# EAGLE design room_ind (EAGLE 6.3)
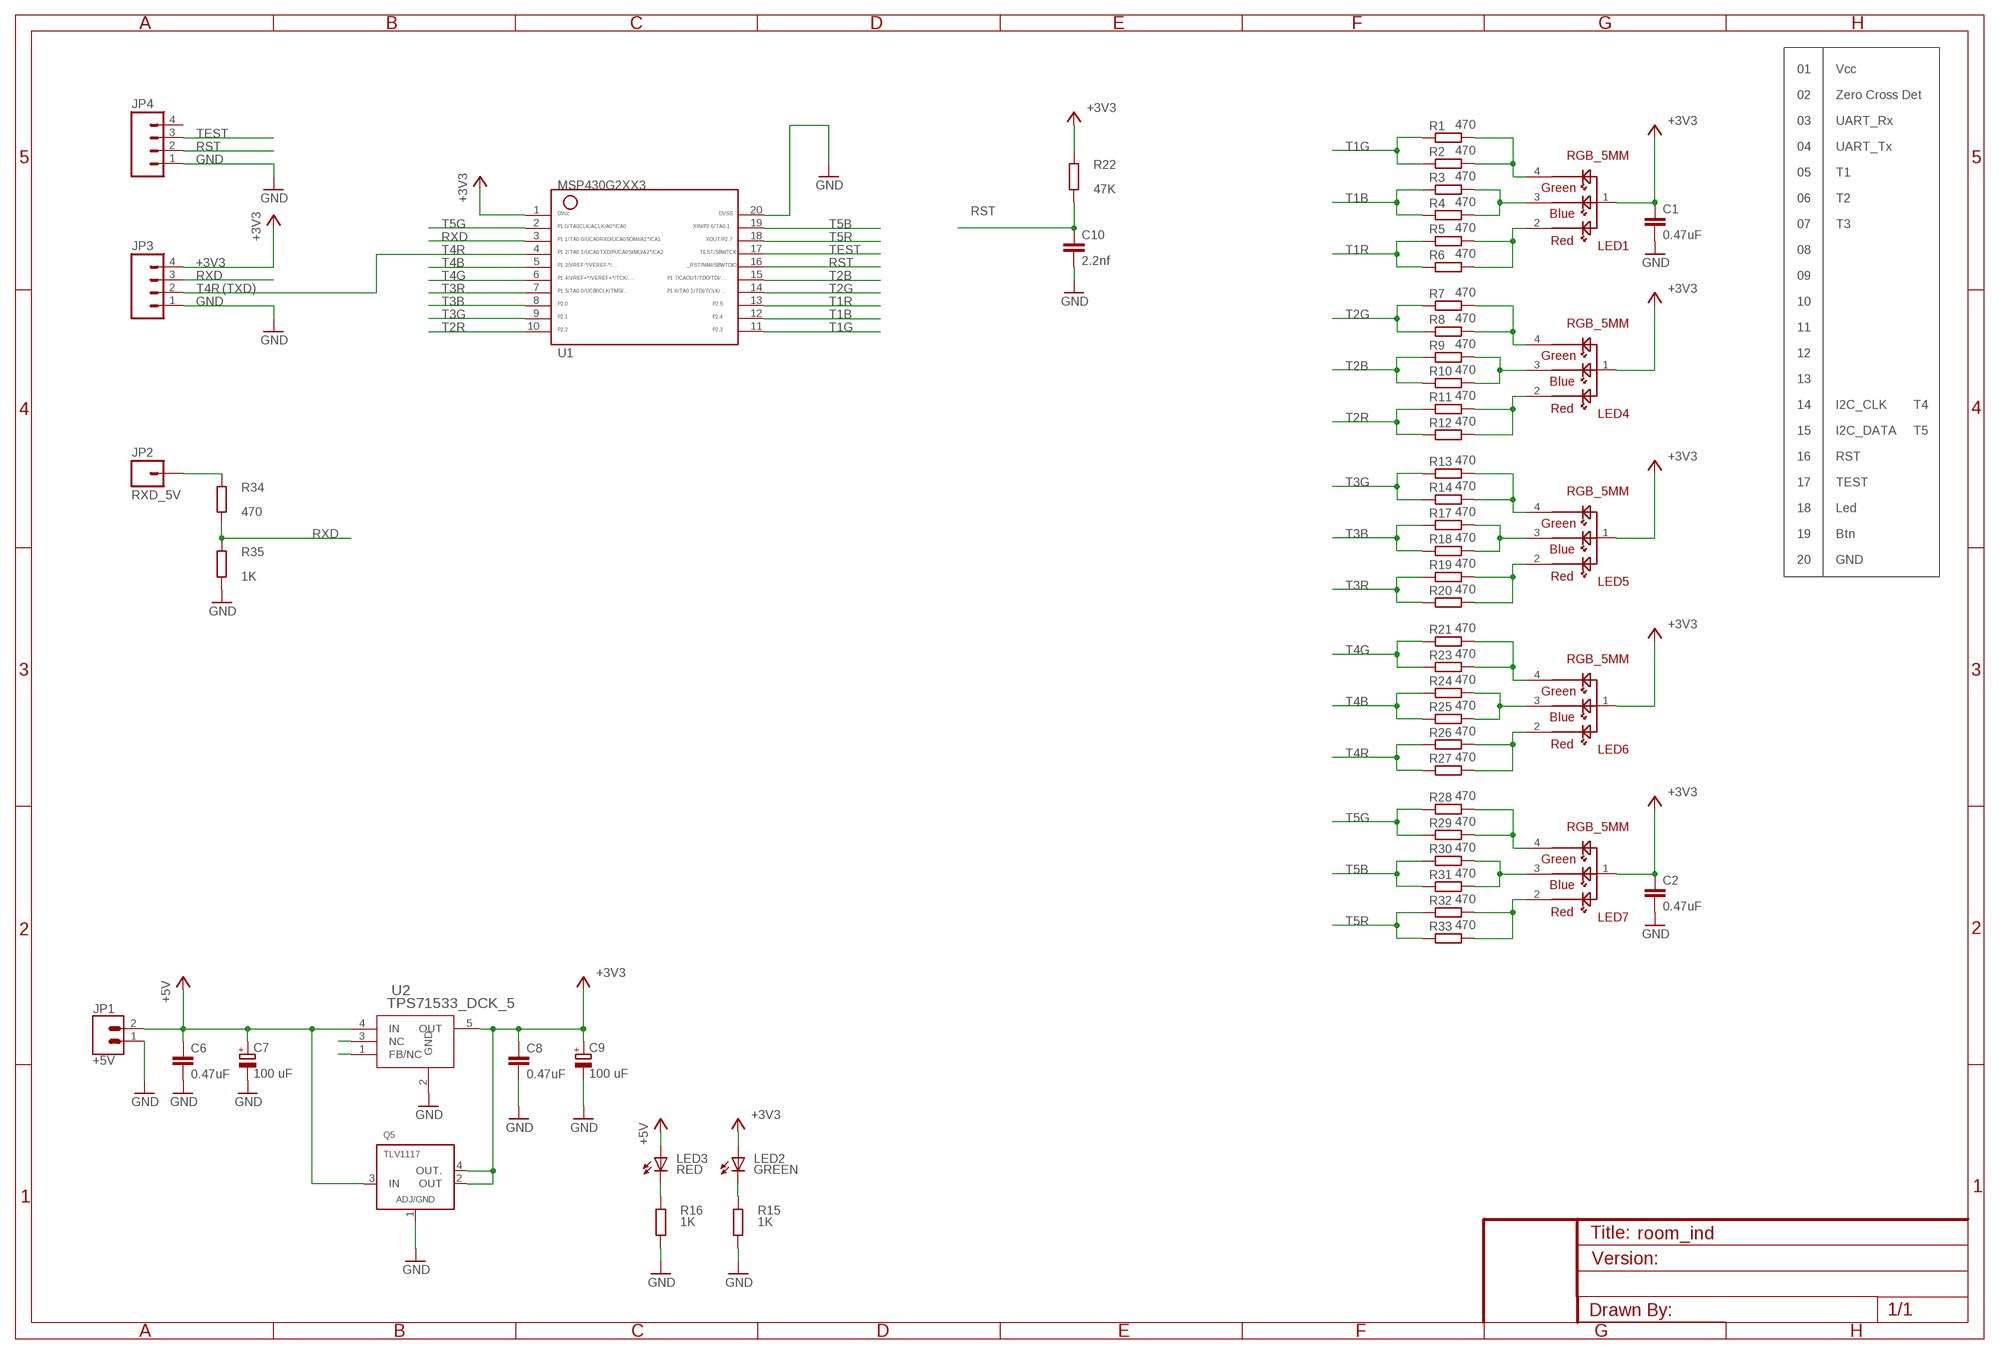
[diagram p0: schematic, sheet 1]

## Parts
C1  0.47uF  C-EUC0805  [C0805]
C2  0.47uF  C-EUC0805  [C0805]
C6  0.47uF  C-EUC0805  [C0805]
C7  100 uF  CPOL-EUE2.5-7  [E2,5-7]
C8  0.47uF  C-EUC0805  [C0805]
C9  100 uF  CPOL-EUE2.5-7  [E2,5-7]
C10  2.2nf  C-EUC0805  [C0805]
JP1  +5V  BLUE_TERM  [BLUE_TERM]
JP2  RXD_5V  M01PTH  [1X01]
JP3  M04PTH  [1X04]
JP4  M04PTH  [1X04]
LED1  RGB_5MM  [RGB_5MM]
LED2  GREEN  LEDCHIP-LED0805  [CHIP-LED0805]
LED3  RED  LEDCHIP-LED0805  [CHIP-LED0805]
LED4  RGB_5MM  [RGB_5MM]
LED5  RGB_5MM  [RGB_5MM]
LED6  RGB_5MM  [RGB_5MM]
LED7  RGB_5MM  [RGB_5MM]
Q5  TLV1117  [SOT223-4]
R1  470  R-EU_R0805  [R0805]
R2  470  R-EU_0207/7  [0207/7]
R3  470  R-EU_R0805  [R0805]
R4  470  R-EU_0207/7  [0207/7]
R5  470  R-EU_R0805  [R0805]
R6  470  R-EU_0207/7  [0207/7]
R7  470  R-EU_R0805  [R0805]
R8  470  R-EU_0207/7  [0207/7]
R9  470  R-EU_R0805  [R0805]
R10  470  R-EU_0207/7  [0207/7]
R11  470  R-EU_R0805  [R0805]
R12  470  R-EU_0207/7  [0207/7]
R13  470  R-EU_R0805  [R0805]
R14  470  R-EU_0207/7  [0207/7]
R15  1K  R-EU_R0805  [R0805]
R16  1K  R-EU_R0805  [R0805]
R17  470  R-EU_R0805  [R0805]
R18  470  R-EU_0207/7  [0207/7]
R19  470  R-EU_R0805  [R0805]
R20  470  R-EU_0207/7  [0207/7]
R21  470  R-EU_R0805  [R0805]
R22  47K  R-EU_R0805  [R0805]
R23  470  R-EU_0207/7  [0207/7]
R24  470  R-EU_R0805  [R0805]
R25  470  R-EU_0207/7  [0207/7]
R26  470  R-EU_R0805  [R0805]
R27  470  R-EU_0207/7  [0207/7]
R28  470  R-EU_R0805  [R0805]
R29  470  R-EU_0207/7  [0207/7]
R30  470  R-EU_R0805  [R0805]
R31  470  R-EU_0207/7  [0207/7]
R32  470  R-EU_R0805  [R0805]
R33  470  R-EU_0207/7  [0207/7]
R34  470  R-EU_R0805  [R0805]
R35  1K  R-EU_R0805  [R0805]
U1  G2XX3---PW20  [PW20]
U2  TPS71533_DCK_5  [DCK5]

## Nets
+3V3 [3V]: C1.1 C2.1 C8.1 C9.+ JP3.4 LED1.1 LED2.A LED4.1 LED5.1 LED6.1 LED7.1 Q5.2(OUT) Q5.4(OUT.) R22.2 U1.1 U2.5(OUT)
+5V [5V]: C6.1 C7.+ JP1.2 LED3.A Q5.3(IN) U2.4(IN)
GND [GND]: C1.2 C2.2 C6.2 C7.- C8.2 C9.- C10.2 JP1.1 JP3.1 JP4.1 Q5.1(ADJ/GND) R15.1 R16.1 R35.1 U1.20 U2.2(GND)
N$1: LED1.3 R3.2 R4.2
N$2: LED1.4 R1.2 R2.2
N$3: LED1.2 R5.2 R6.2
N$4: JP2.1 R34.2
N$7: LED2.C R15.2
N$8: LED3.C R16.2
N$10: LED4.3 R9.2 R10.2
N$11: LED4.4 R7.2 R8.2
N$12: LED4.2 R11.2 R12.2
N$16: LED5.3 R17.2 R18.2
N$17: LED5.4 R13.2 R14.2
N$18: LED5.2 R19.2 R20.2
N$22: LED6.3 R24.2 R25.2
N$23: LED6.4 R21.2 R23.2
N$24: LED6.2 R26.2 R27.2
N$28: LED7.3 R30.2 R31.2
N$29: LED7.4 R28.2 R29.2
N$30: LED7.2 R32.2 R33.2
N$32: U2.3(NC)
N$33: U2.1(FB/NC)
RST: C10.1 JP4.2 R22.1 U1.16
RXD: JP3.3 R34.1 R35.2 U1.3
T1B: R3.1 R4.1 U1.12
T1G: R1.1 R2.1 U1.11
T1R: R5.1 R6.1 U1.13
T2B: R9.1 R10.1 U1.15
T2G: R7.1 R8.1 U1.14
T2R: R11.1 R12.1 U1.10
T3B: R17.1 R18.1 U1.8
T3G: R13.1 R14.1 U1.9
T3R: R19.1 R20.1 U1.7
T4B: R24.1 R25.1 U1.5
T4G: R21.1 R23.1 U1.6
T4R: JP3.2 R26.1 R27.1 U1.4
T5B: R30.1 R31.1 U1.19
T5G: R28.1 R29.1 U1.2
T5R: R32.1 R33.1 U1.18
TEST: JP4.3 U1.17
Unconnected: JP4.4

## Notes on the sheet
- 01 | Vcc
- 02 | Zero Cross Det
- 03 | UART_Rx
- 04 | UART_Tx
- 05 | T1
- 06 | T2
- 07 | T3
- 08
- 09
- (TXD)
- 10
- 11
- 12
- 13
- 14 | I2C_CLK | T4
- 15 | I2C_DATA | T5
- 16 | RST
- 17 | TEST
- 18 | Led
- 19 | Btn
- 20 | GND

## Library data of the parts
C1 C2 C6 C8 C10 = rcl:C-EU: CAPACITOR, European symbol
C7 C9 = rcl:CPOL-EU: POLARIZED CAPACITOR, European symbol
JP1 = jlab:BLUE_TERM
JP2 = SparkFun-Connectors:M01: Header 1 Standard 1-pin 0.1" header. Use with straight break away headers (SKU : PRT-00116), right angle break away headers (PRT-00553), swiss pins (PRT-00743), machine pins (PRT-00117), and female headers (PRT-00115).
JP3 JP4 = SparkFun:M04: Header 4 Standard 4-pin 0.1" header. Use with straight break away headers (SKU : PRT-00116), right angle break away headers (PRT-00553), swiss pins (PRT-00743), machine pins (PRT-00117), and female headers (PRT-00115). Molex polarized connector foot print use with SKU : PRT-08231 with associated crimp pins and housings. 1MM SMD Version SKU: PRT-10208
LED1 LED4-LED7 = jlab:RGB_5MM
LED2 LED3 = jlab:LED: LED OSRAM: - CHIPLED LG R971, LG N971, LY N971, LG Q971, LY Q971, LO R971, LY R971 LH N974, LH R974 LS Q976, LO Q976, LY Q976 LO Q996 - Hyper CHIPLED LW Q18S LB Q993, LB Q99A, LB R99A - SideLED LS A670, LO A670, LY A670, LG A670, LP A670 LB A673, LV A673, LT A673, LW A673 LH A674 LY A675 LS A676, LA A676, LO A676, LY A676, LW A676 LS A679, LY A679, LG A679 - Hyper Micro SIDELED® LS Y876, LA Y876, LO Y876, LY Y876 LT Y87S - SmartLED LW L88C, LW L88S LB L89C, LB L89S, LG L890 LS L89K, LO L89K, LY L89K LS L896, LA L896, LO L896, LY L896 - TOPLED LS T670, LO T670, LY T670, LG T670, LP T670 LSG T670, LSP T670, LSY T670, LOP T670, LYG T670 LG T671, LOG T671, LSG T671 LB T673, LV T673, LT T673, LW T673 LH T674 LS T676, LA T676, LO T676, LY T676, LB T676, LH T676, LSB T676, LW T676 LB T67C, LV T67C, LT T67C, LS T67K, LO T67K, LY T67K, LW E67C LS E67B, LA E67B, LO E67B, LY E67B, LB E67C, LV E67C, LT E67C LW T67C LS T679, LY T679, LG T679 LS T770, LO T770, LY T770, LG T770, LP T770 LB T773, LV T773, LT T773, LW T773 LH T774 LS E675, LA E675, LY E675, LS T675 LS T776, LA T776, LO T776, LY T776, LB T776 LHGB T686 LT T68C, LB T68C - Hyper Mini TOPLED® LB M676 - Mini TOPLED Santana® LG M470 LS M47K, LO M47K, LY M47K Source: http://www.osram.convergy.de LUXEON: - LUMILED® LXK2-PW12-R00, LXK2-PW12-S00, LXK2-PW14-U00, LXK2-PW14-V00 LXK2-PM12-R00, LXK2-PM12-S00, LXK2-PM14-U00 LXK2-PE12-Q00, LXK2-PE12-R00, LXK2-PE12-S00, LXK2-PE14-T00, LXK2-PE14-U00 LXK2-PB12-K00, LXK2-PB12-L00, LXK2-PB12-M00, LXK2-PB14-N00, LXK2-PB14-P00, LXK2-PB14-Q00 LXK2-PR12-L00, LXK2-PR12-M00, LXK2-PR14-Q00, LXK2-PR14-R00 LXK2-PD12-Q00, LXK2-PD12-R00, LXK2-PD12-S00 LXK2-PH12-R00, LXK2-PH12-S00 LXK2-PL12-P00, LXK2-PL12-Q00, LXK2-PL12-R00 Source: www.luxeon.com KINGBRIGHT: KA-3528ASYC Source: www.kingbright.com
Q5 = ti-parts:TLV1117: LDO VOLTAGE REGULATOR
R1-R35 = rcl:R-EU_: RESISTOR, European symbol
U1 = TI_MSP430_v16:G2XX3---PW20: MSP430G2XX1 TSSOP (PW) 20 Pin Package
U2 = ti_exports:TPS71533_DCK_5; DATASHEETURL: http://www.ti.com/lit/gpn/TPS71533; DESCRIPTION: Single Output LDO, 50mA, Fixed(3.3V), High Input Voltage, Low Quiescent Current; FAMILY_NAME: SINGLE CHANNEL LDO; GENERIC_PART_NUMBER: TPS71533; INDUSTRY_STD_PKG_TYPE: SC70; MANUFACTURER: Texas Instruments; MANUFACTURER_PART_NUMBER: tps71533_dck_5; PACKAGE_DESIGNATOR: DCK; PIN_COUNT: 5; VENDOR: Texas Instruments

## Net classes
1 5V: width 0.305 mm, drill 0.305 mm, clearance 0.305 mm
2 3V: width 0.305 mm, drill 0.305 mm, clearance 0.305 mm
3 GND: width 0.305 mm, clearance 0.305 mm

## Board
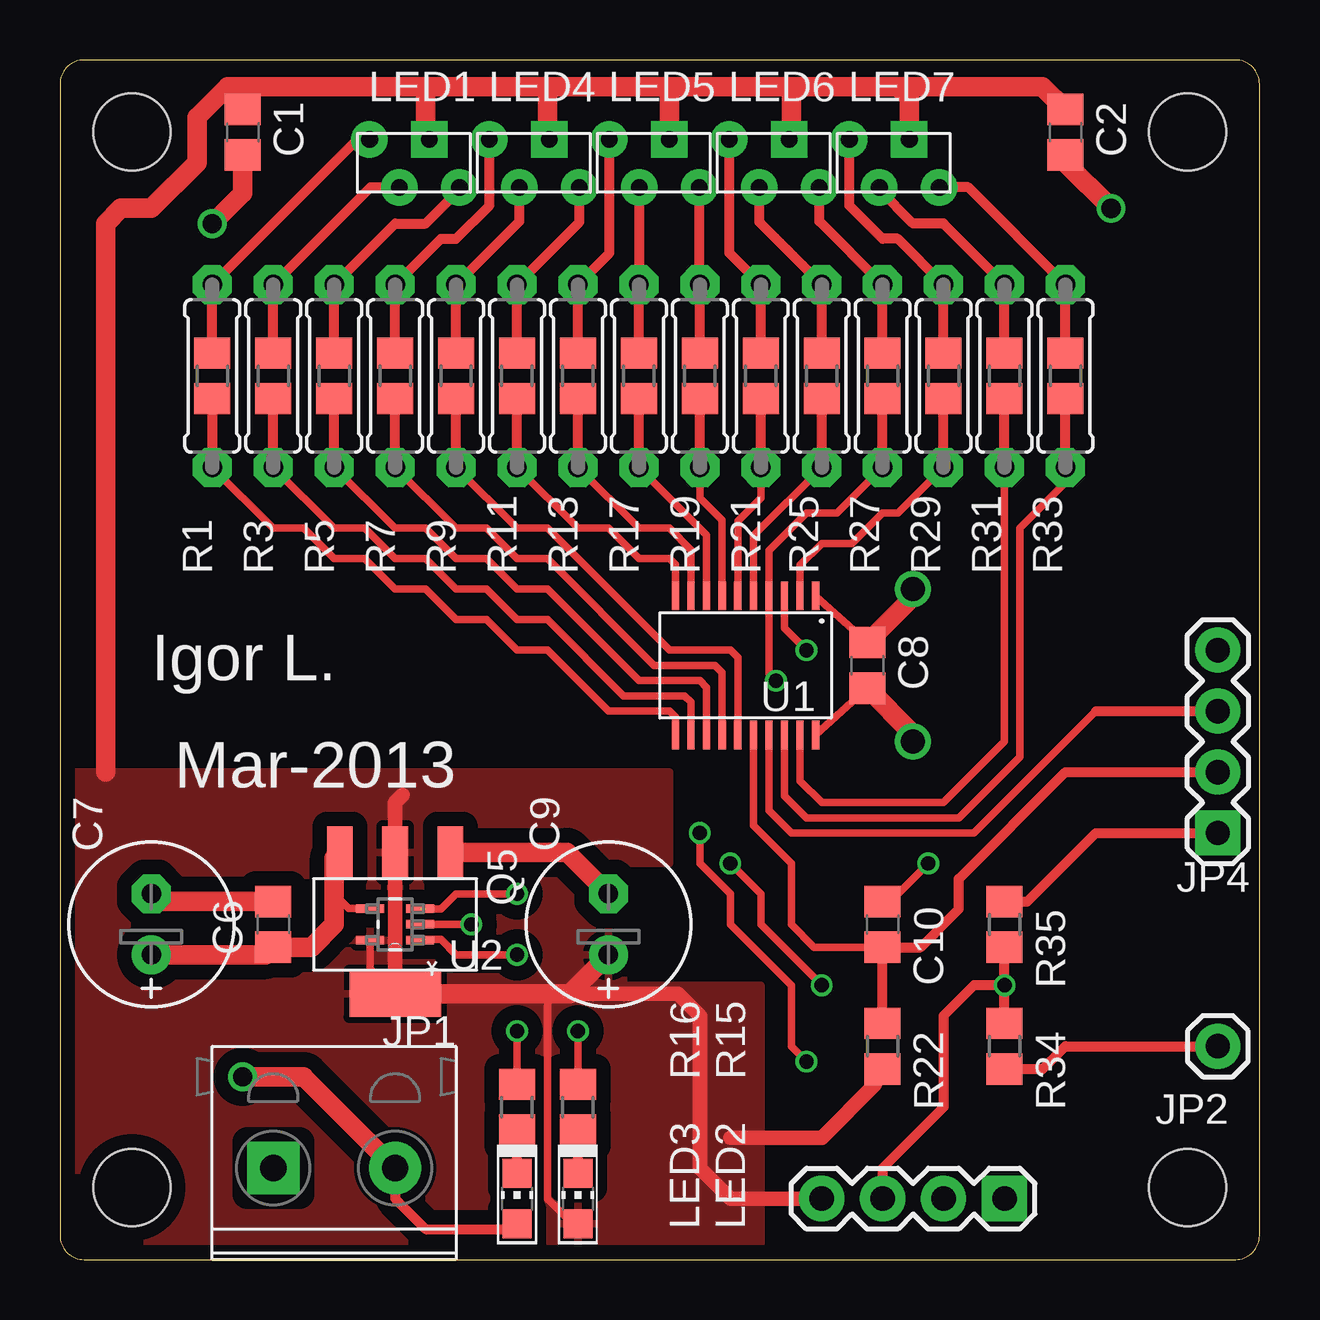
[diagram p1: board, top side]
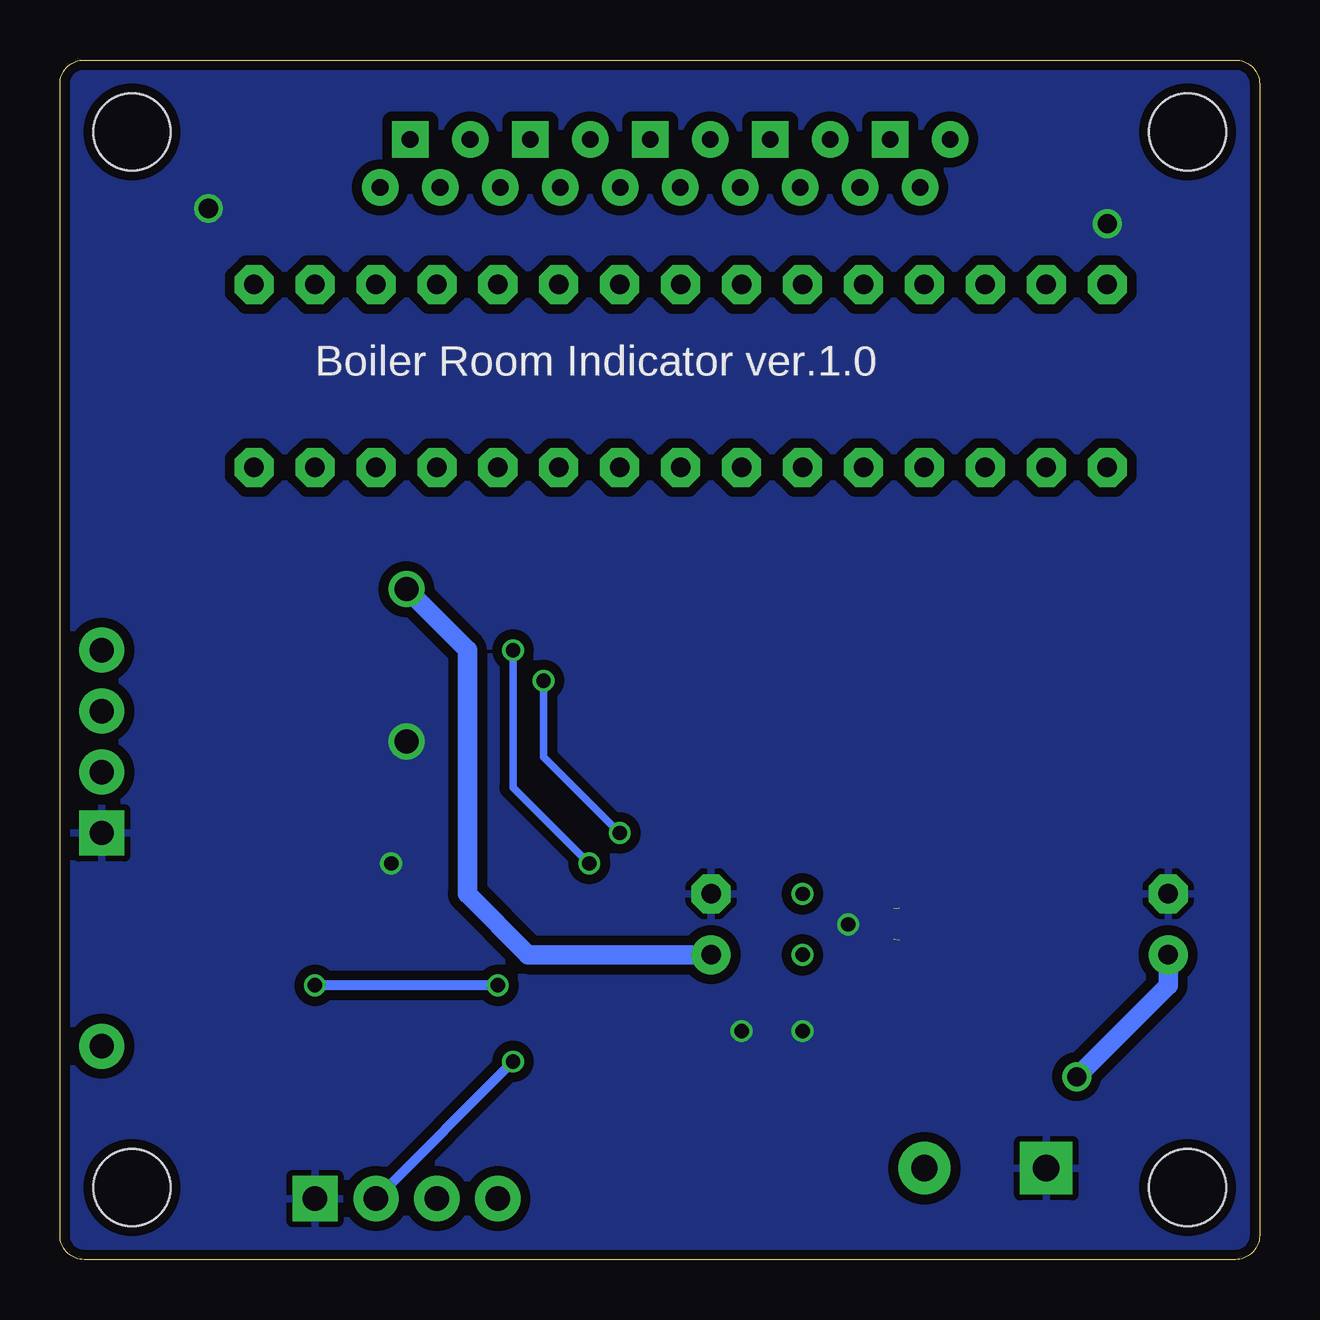
[diagram p2: board, bottom side, seen from below]

Size 50 x 50 mm. Coordinates in mm from the lower left corner, seen from the top.
Outline: 0,1 arc90 1,0 49,0 arc90 50,1 50,49 arc90 49,50 1,50 arc90 0,49 0,1
Copper layers (1*16): Top 0.035mm / dielectric 1.5mm / Bottom 0.035mm
Design rules "msp430 *": minimum track width 11mil, minimum drill 0.6mm, track to track 6mil, track to pad 6mil, pad to pad 6mil, via to via 6mil, smd to smd 0mil, copper to edge 10mil, drill to drill 10mil, minimum pad ring 16mil, minimum via ring 6mil, stop-mask expansion 2mil, vias tented up to drill 40mil, thermal gap 10mil
Holes 3.2 mm at 3,3 47,3 47,47 3,47

### Footprints (pad centres in the part's own frame; a part is rotated, then mirrored left to right if it is on the bottom)
C0805 = smd 1.3 x 1.5: 1 -0.95,0; 2 0.95,0
E2,5-7 = drill 0.813 pad 1.6: + -1.27,0 | drill 0.813 pad 1.6 octagon: - 1.27,0
BLUE_TERM = drill 1.1 pad 2.184 square: 1 0,2.54 | drill 1.1 pad 2.184: 2 0,-2.54
1X01 = drill 1.016 pad 1.88: 1 0,0
1X04 = drill 1.016 pad 1.88 square: 1 0,0 | drill 1.016 pad 1.88: 2 2.54,0; 3 5.08,0; 4 7.62,0
RGB_5MM = drill 0.7 square: 1 -0.969,1.27 | drill 0.7: 2 1.031,2.52; 3 1.031,0.02; 4 -0.969,-1.23
CHIP-LED0805 = smd 1.2 x 1.2: A 0,-1.05; C 0,1.05
SOT223-4 = smd 1.067 x 2.184: 1 -2.3,-3; 2 0,-3; 3 2.3,-3 | smd 3.81 x 1.93: 4 0,2.9
R0805 = smd 1.3 x 1.5: 1 -0.95,0; 2 0.95,0
0207/7 = drill 0.813 octagon: 1 -3.81,0; 2 3.81,0
PW20 = smd 0.3 x 1.2: 1 -2.925,-2.9; 2 -2.275,-2.9; 3 -1.625,-2.9; 4 -0.975,-2.9; 5 -0.325,-2.9; 6 0.325,-2.9; 7 0.975,-2.9; 8 1.625,-2.9; 9 2.275,-2.9; 10 2.925,-2.9; 11 2.925,2.9; 12 2.275,2.9; 13 1.625,2.9; 14 0.975,2.9; 15 0.325,2.9; 16 -0.325,2.9; 17 -0.975,2.9; 18 -1.625,2.9; 19 -2.275,2.9; 20 -2.925,2.9
DCK5 = smd 1.168 x 0.356: 1 -1.041,0.66; 2 -1.041,0; 3 -1.041,-0.66; 4 1.041,-0.66; 5 1.041,0.66

### Placement (x,y rotation side)
C1  7.62,46.99 270 top
C2  41.91,46.99 270 top
C6  8.89,13.97 90 top
C7  3.81,13.97 90 top
C8  33.66,24.77 270 top
C9  22.86,13.97 90 top
C10  34.29,13.97 90 top
JP1  11.43,3.81 90 top
JP2  48.26,8.89 0 top
JP3  39.37,2.54 180 top
JP4  48.26,17.78 90 top
LED1  14.13,45.72 270 top
LED2  21.59,2.54 0 top
LED3  19.05,2.54 0 top
LED4  19.13,45.72 270 top
LED5  24.13,45.72 270 top
LED6  29.13,45.72 270 top
LED7  34.13,45.72 270 top
Q5  13.97,13.97 180 top
R1  6.35,36.83 90 top
R2  6.35,36.83 90 top
R3  8.89,36.83 90 top
R4  8.89,36.83 90 top
R5  11.43,36.83 90 top
R6  11.43,36.83 90 top
R7  13.97,36.83 90 top
R8  13.97,36.83 90 top
R9  16.51,36.83 90 top
R10  16.51,36.83 90 top
R11  19.05,36.83 90 top
R12  19.05,36.83 90 top
R13  21.59,36.83 90 top
R14  21.59,36.83 90 top
R15  21.59,6.35 270 top
R16  19.05,6.35 270 top
R17  24.13,36.83 90 top
R18  24.13,36.83 90 top
R19  26.67,36.83 90 top
R20  26.67,36.83 90 top
R21  29.21,36.83 90 top
R22  34.29,8.89 270 top
R23  29.21,36.83 90 top
R24  31.75,36.83 90 top
R25  31.75,36.83 90 top
R26  34.29,36.83 90 top
R27  34.29,36.83 90 top
R28  36.83,36.83 90 top
R29  36.83,36.83 90 top
R30  39.37,36.83 90 top
R31  39.37,36.83 90 top
R32  41.91,36.83 90 top
R33  41.91,36.83 90 top
R34  39.37,8.89 270 top
R35  39.37,13.97 270 top
U1  28.57,24.77 180 top
U2  13.97,13.97 180 top

### Tracks (layer width: path | path; a pad name or v marks a point on that pad's centre or on a via)
+3V3  (via drill 1)
  Top 0.305: U2.5 12.93,12.11 Q5.4 | LED2.A 21.37,1.49 20.32,2.54 20.32,11.07 | R22.2 33.97,7.62 | U1.1 C8.1
  Top 0.61: Q5.4 Q5.2 13.97,19.05 14.29,19.37 | JP3.4 27.94,2.54 26.67,3.81 26.67,10.16 25.76,11.07 20.32,11.07 | 33.97,7.62 33.97,7.3 31.75,5.08 27.94,5.08
  Top 0.813: Q5.4 20.32,11.07 21.23,11.07 C9.+ | C8.1 35.56,27.62 v35.56,27.94 | LED7.1 35.4,48.42 34.92,48.9 | 34.92,48.9 30.48,48.9 | 30.48,48.9 25.4,48.9 | 25.4,48.9 20.32,48.9 | 20.32,48.9 15.24,48.9 | 15.24,48.9 7.62,48.9 | 7.62,48.9 6.99,48.9 5.71,47.62 5.71,45.72 3.81,43.81 2.54,43.81 1.91,43.18 1.91,20.32 | LED1.1 15.24,46.85 15.24,48.9 | LED4.1 20.32,46.77 20.32,48.9 | LED5.1 25.4,48.9 | LED6.1 30.48,46.77 30.48,48.9 | 34.92,48.9 40.95,48.9 C2.1 | C1.1 7.62,48.9
  Bottom 0.813: v35.56,27.94 33.02,25.4 33.02,15.24 30.48,12.7 C9.+
  pour Top (isolate 0.61): 0,20.32 25.4,20.32 25.4,16.51 23.5,16.51 23.5,11.43 29.21,11.43 29.21,0 1,0 arc-90 0,1
+5V  (via drill 0.8)
  Top 0.305: U2.4 12.04,14.63 11.43,15.24
  Top 0.406: JP1.2 13.97,2.54 15.24,1.27 18.83,1.27 LED3.A
  Top 0.813: C7.+ 8.57,12.7 C6.1 10.48,13.02 11.43,13.97 11.43,15.24 11.43,16.73 Q5.3 | JP1.2 10.16,7.62 v7.62,7.62
  Bottom 0.813: v7.62,7.62 3.81,11.43 C7.+
GND  (via drill 0.6, 0.8, 1)
  Top 0.305: U2.2 v17.14,13.97 | R16.1 v19.05,9.53 | R15.1 v21.59,9.53 | C10.2 34.6,14.92 v36.2,16.51 | U1.20 C8.2
  Top 0.406: R35.1 40.32,14.92 43.18,17.78 JP4.1
  Top 0.813: C6.2 4.13,14.92 C7.- | Q5.1 21.13,16.97 C9.- | C8.2 35.56,21.91 v35.56,21.59 | C1.2 7.62,44.45 v6.35,43.18 | C2.2 41.91,45.72 v43.81,43.81
  pour Bottom (isolate 0.406, rank 6): 0,49 0,1 arc90 1,0 49,0 arc90 50,1 50,49 arc90 49,50 1,50 arc90
N$1
  Top 0.406: LED1.3 12.94,44.69 R4.2 R3.2
N$2
  Top 0.406: R1.2 R2.2 12.4,46.69 LED1.4
N$3
  Top 0.406: LED1.2 16.65,44.59 15.24,43.18 13.97,43.18 R6.2 R5.2
N$4
  Top 0.406: R34.2 40.96,7.94 41.91,8.89 JP2.1
N$7
  Top 0.406: LED2.C R15.2
N$8
  Top 0.406: LED3.C R16.2
N$10
  Top 0.406: LED4.3 19.15,43.28 R10.2 R9.2
N$11
  Top 0.406: LED4.4 17.9,43.94 16.51,42.55 15.88,42.55 R8.2 R7.2
N$12
  Top 0.406: LED4.2 21.65,43.24 R12.2 R11.2
N$16
  Top 0.406: LED5.3 24.15,40.64 R18.2 R17.2
N$17
  Top 0.406: LED5.4 22.9,41.95 R14.2 R13.2
N$18
  Top 0.406: LED5.2 26.65,40.66 R20.2 R19.2
N$22
  Top 0.406: LED6.3 29.15,43.24 R25.2 R24.2
N$23
  Top 0.406: LED6.4 27.9,41.95 R23.2 R21.2
N$24
  Top 0.406: LED6.2 31.65,43.28 R27.2 R26.2
N$28
  Top 0.406: LED7.3 34.15,44.59 35.56,43.18 36.83,43.18 R31.2 R30.2
N$29
  Top 0.406: LED7.4 32.9,43.94 34.29,42.55 34.92,42.55 R29.2 R28.2
N$30
  Top 0.406: LED7.2 37.86,44.69 R33.2 R32.2
N$32  (via drill 0.6)  (1 unrouted)
  Top 0.305: 15.24,14.61 15.88,14.61 16.51,15.24 v19.05,15.24
N$33  (via drill 0.6)  (1 unrouted)
  Top 0.305: 15.24,13.34 15.88,13.34 16.51,12.7 v19.05,12.7
RST
  Top 0.305: C10.1 31.43,13.02 30.48,13.97 30.48,16.51 28.9,18.09 U1.16
  Top 0.406: JP4.2 41.91,20.32 37.47,15.88 37.47,14.61 35.88,13.02 C10.1 R22.1
RXD  (via drill 0.6)
  Top 0.305: U1.3 30.2,26.32 v31.11,25.4 | v27.94,16.51 29.21,15.24 29.21,13.97 v31.75,11.43
  Top 0.406: R34.1 v39.37,11.43 | v39.37,11.43 R35.2 | v39.37,11.43 38.1,11.43 36.83,10.16 36.83,6.35 34.29,3.81 JP3.3
  Bottom 0.305: v31.11,25.4 31.11,19.68 v27.94,16.51
  Bottom 0.406: v31.75,11.43 v39.37,11.43
T1B
  Top 0.305: U1.12 26.3,23.23 26.04,23.5 23.5,23.5 20.32,26.67 19.05,26.67 17.78,27.94 16.51,27.94 15.24,29.21 13.97,29.21 12.7,30.48 11.43,30.48 R4.1
  Top 0.406: R4.1 R3.1
T1G
  Top 0.305: U1.11 25.65,22.61 25.4,22.86 22.86,22.86 20.32,25.4 19.05,25.4 17.78,26.67 16.51,26.67 15.24,27.94 13.97,27.94 12.7,29.21 11.43,29.21 10.16,30.48 8.89,30.48 R2.1
  Top 0.406: R1.1 R2.1
T1R
  Top 0.305: R6.1 13.97,30.48 15.24,30.48 16.51,29.21 17.78,29.21 19.05,27.94 20.32,27.94 24.13,24.13 26.67,24.13 26.95,23.85 U1.13
  Top 0.406: R6.1 R5.1
T2B
  Top 0.305: R10.1 19.05,30.48 20.32,30.48 25.4,25.4 27.94,25.4 28.25,25.09 U1.15
  Top 0.406: R10.1 R9.1
T2G
  Top 0.305: R8.1 16.51,30.48 17.78,30.48 19.05,29.21 20.32,29.21 24.77,24.77 27.3,24.77 27.6,24.47 U1.14
  Top 0.406: R8.1 R7.1
T2R
  Top 0.305: R12.1 21.59,30.48 22.86,30.48 24.13,29.21 25.4,29.21 25.65,28.96 U1.10
  Top 0.406: R12.1 R11.1
T3B
  Top 0.305: U1.8 26.95,30.2 R18.1
  Top 0.406: R18.1 R17.1
T3G
  Top 0.305: U1.9 26.3,29.58 25.4,30.48 24.13,30.48 R14.1
  Top 0.406: R14.1 R13.1
T3R
  Top 0.305: U1.7 27.6,30.82 26.67,31.75 R20.1
  Top 0.406: R20.1 R19.1
T4B
  Top 0.305: U1.5 28.9,30.17 R25.1
  Top 0.406: R25.1 R24.1
T4G
  Top 0.305: U1.6 28.25,30.79 29.21,31.75 R23.1
  Top 0.406: R23.1 R21.1
T4R  (via drill 0.6)
  Top 0.305: R27.1 32.38,31.11 31.11,31.11 29.55,29.55 U1.4 29.55,24.43 v29.84,24.13 | v26.67,17.78 26.67,16.51 27.94,15.24 27.94,13.97 30.48,11.43 30.48,8.89 v31.11,8.26
  Top 0.406: R27.1 R26.1
  Bottom 0.305: v29.84,24.13 29.84,20.95 v26.67,17.78
  Bottom 0.406: v31.11,8.26 JP3.2
T5B
  Top 0.305: R31.1 39.37,21.59 36.83,19.05 31.75,19.05 30.85,19.95 U1.19
  Top 0.406: R31.1 R30.1
T5G
  Top 0.305: U1.2 30.85,28.95 31.75,29.84 33.02,29.84 34.29,31.11 34.92,31.11 R29.1
  Top 0.406: R29.1 R28.1
T5R
  Top 0.305: U1.18 30.2,19.33 31.11,18.41 37.47,18.41 40.01,20.95 40.01,30.48 41.91,32.38 R33.1
  Top 0.406: R33.1 R32.1
TEST
  Top 0.305: U1.17 29.55,18.71 30.48,17.78 38.1,17.78 43.18,22.86
  Top 0.406: 43.18,22.86 JP4.3

### Text on the board
tNames: Igor L. | Mar-2013
bNames: Boiler Room Indicator ver.1.0
tDocu: Test / / Rst / / GND | Rx_5V | +5V | Vcc / Rx / Tx / GND